# Altium schematic sheet Sheet1.SchDoc
size A4
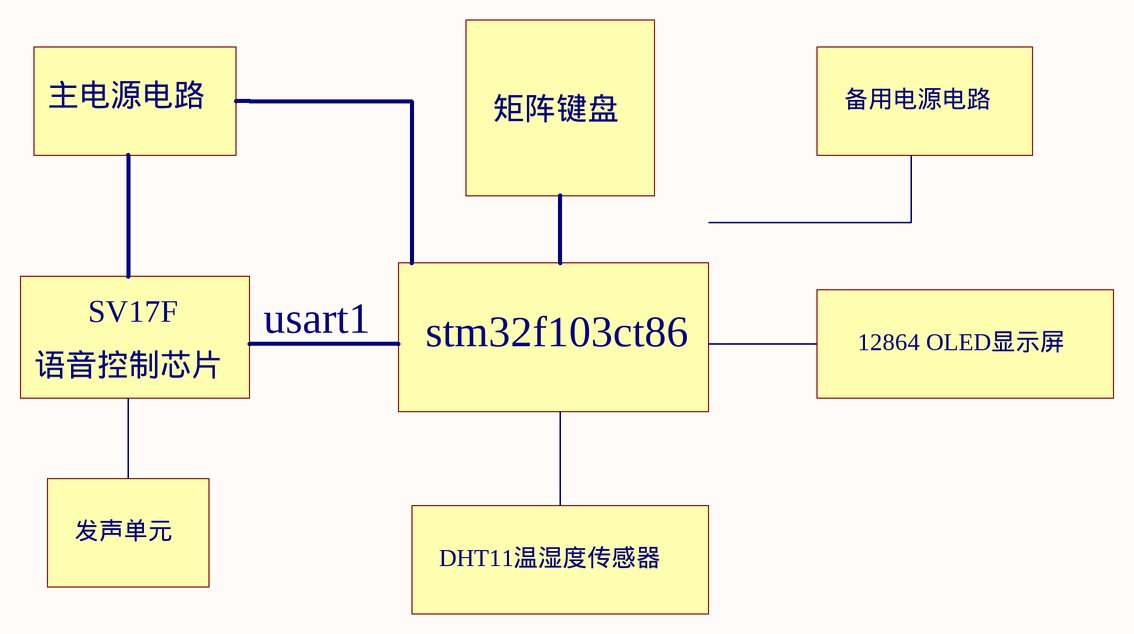
[diagram p0: Sheet1.SchDoc]

## Notes on the sheet
- 主电源电路
- 矩阵键盘
- 备用电源电路
- SV17F
- usart1
- stm32f103ct86
- 12864 OLED显示屏
- 语音控制芯片
- 发声单元
- DHT11温湿度传感器